# EasyEDA Pro project G-CU_2023-06-21_21-38-10.eprj, board PCB1
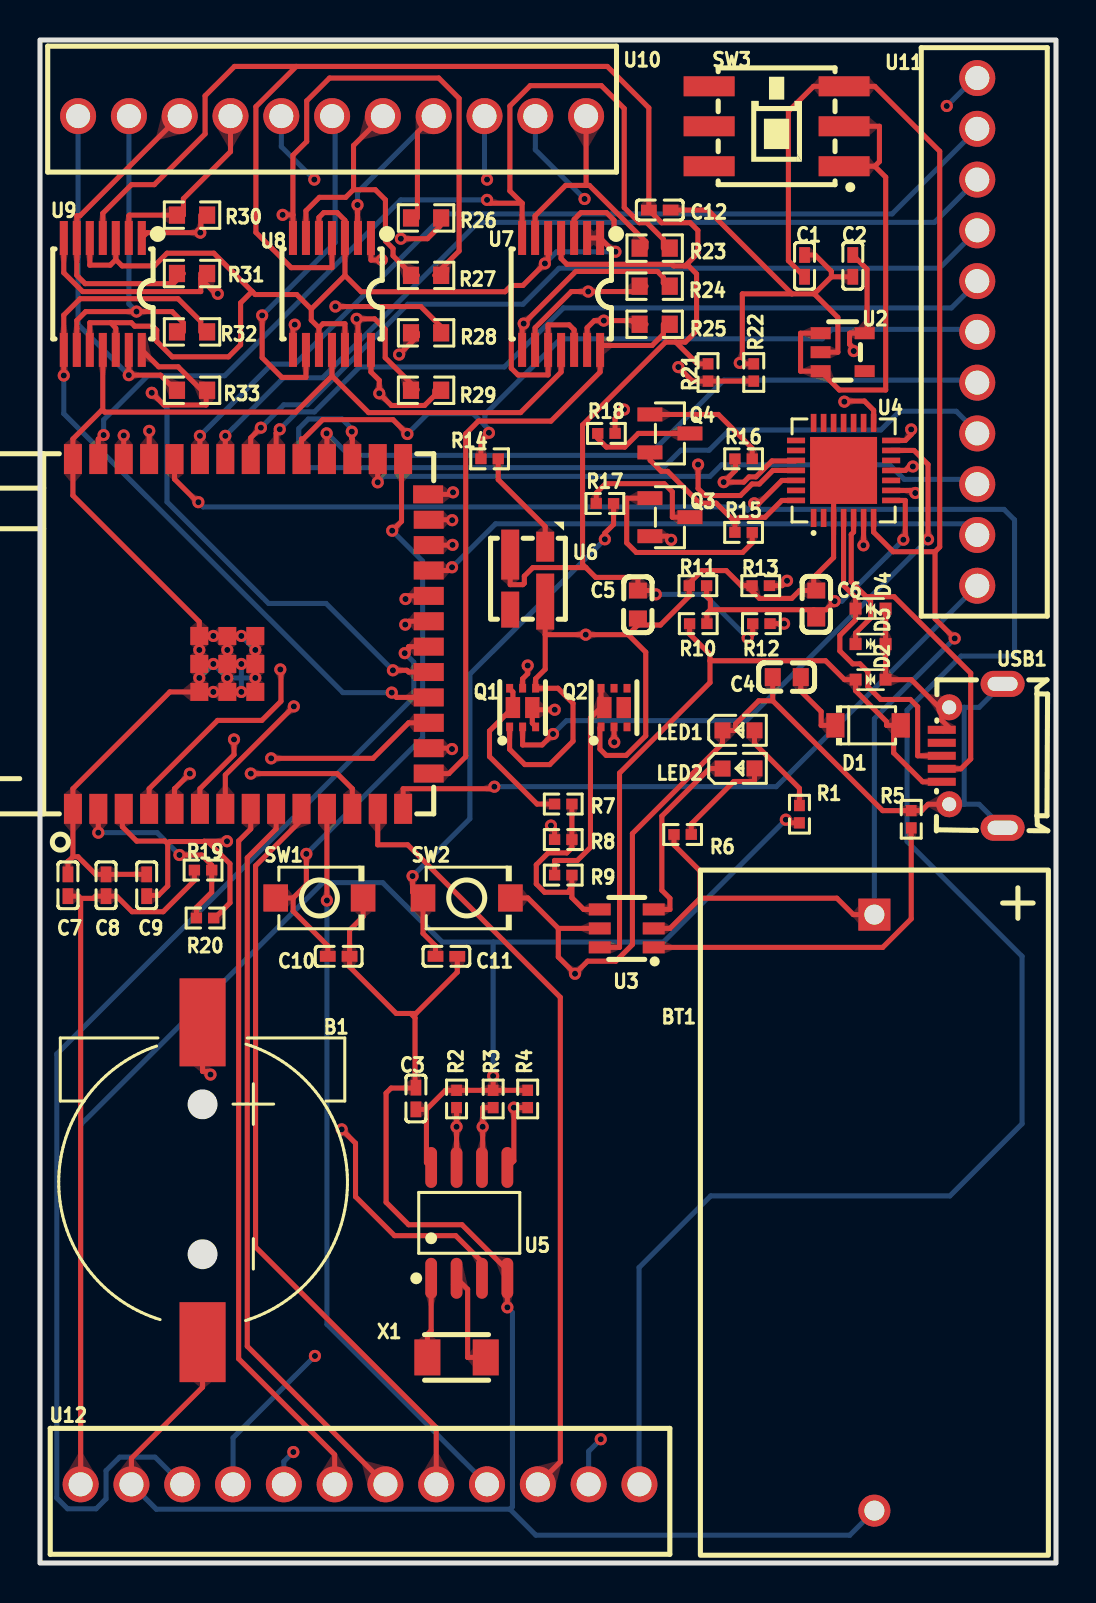
[diagram p1: board, top side]
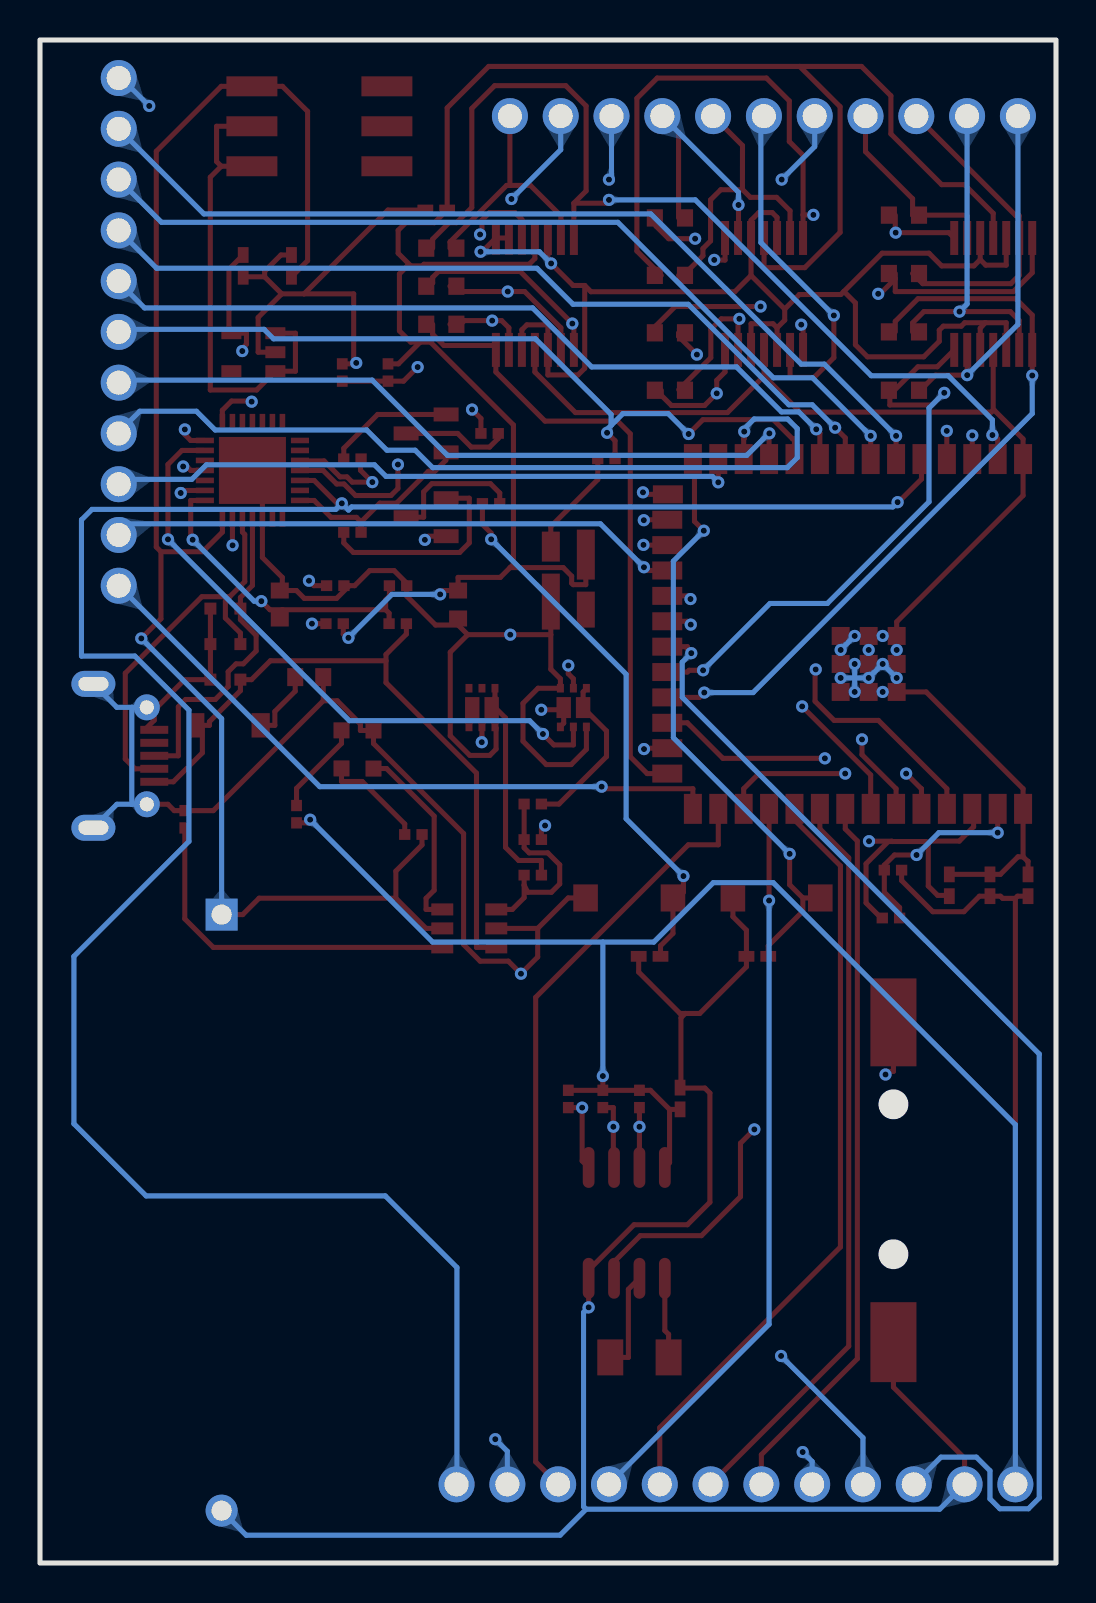
[diagram p2: board, bottom side, seen from below]

Outline 50.8 x 76.2 mm; copper layers: Top Layer, 信号层1, 信号层2, Bottom Layer. Coordinates in mm from the lower left corner of the outline.
Outline path: rectangle 0,76.2 50.8,0
Stack: Top Layer 0.035mm / Dielectric1 0.48mm PP er 4.5 / 信号层1 0.035mm / Dielectric2 0.48mm FR4 er 4.5 / 信号层2 0.035mm / Dielectric3 0.48mm PP er 4.5 / Bottom Layer 0.035mm

## Design rules (mm)
template: 自定义配置
spacing copperThickness1oz (default): track to track 0.102, other pairs 0.152 to 0.3
spacing copperThickness2oz: track to track 0.203, other pairs 0.152 to 0.3
spacing copperThicknessInner0.5oz: track to track 0.089, other pairs 0.152 to 0.3
track width copperThickness1oz (default): min 0.102, default 0.254, max 2.54
track width copperThickness2oz: min 0.203, default 0.254, max 2.54
track width copperThickness0.5oz: min 0.089, default 0.254, max 2.54
differential pair differentialPair (default): width min 0.127, default 0.254, max 2.54; gap min 0.152, default 0.152
via viaSize (default): diameter min 0.3, default 0.61, max 10; hole min 0.201, default 0.305, max 6.299

## Placement (name value [footprint] x y rotation side)
B1  CR1220-2  [BAT-SMD_CR1220-2]  8.13 19.05 270 top
BT1  BH-14250-A1AJ001  [14250]  50.42 34.67 270 top
C1  1uF  [c0402]  38.23 64.9 270 top
C2  1uF  [C0402]  40.64 64.9 90 top
C3  1uF  [C0402]  18.8 23.24 270 top
C4  10uF  [C0603]  37.34 44.32 0 top
C5  10uF  [C0603]  29.9 47.96 90 top
C6  1uF  [C0603]  38.81 47.96 270 top
C7  10uF  [C0402]  1.4 33.91 270 top
C8  100pF  [C0402]  3.3 33.91 270 top
C9  1uF  [C0402]  5.33 33.91 270 top
C10  100pF  [C0402]  14.93 30.35 180 top
C11  100pF  [C0402]  20.32 30.35 180 top
C12  100pF  [C0402]  30.99 67.69 0 top
D1  1N5819HW-7-F  [SOD-123_L2.7-W1.6-LS3.7-RD]  41.4 41.91 0 top
D2  LESD5D5.0CT1G  [SOD-523_L1.2-W0.8-LS1.6-BI]  41.53 44.2 180 top
D3  LESD5D5.0CT1G  [SOD-523_L1.2-W0.8-LS1.6-BI]  41.53 45.97 180 top
D4  LESD5D5.0CT1G  [SOD-523_L1.2-W0.8-LS1.6-BI]  41.53 47.75 180 top
LED1  NCD0603R1  [LED0603-RD_RED]  34.93 41.66 0 top
LED2  NCD0603G1  [LED0603-RD]  34.93 39.75 0 top
Q1  CSD87502Q2  [DFN-6L_L2.0-W2.0-P0.65-BL-EP]  24.13 42.8 0 top
Q2  CSD87502Q2  [DFN-6L_L2.0-W2.0-P0.65-BL-EP]  28.7 42.8 0 top
Q3  L8050QLT1G  [SOT-23-3_L2.9-W1.3-P1.90-LS2.4-BR]  31.5 52.32 180 top
Q4  L8050QLT1G  [SOT-23-3_L2.9-W1.3-P1.90-LS2.4-BR]  31.5 56.51 180 top
R1  5.1kΩ  [R0402]  37.97 37.46 90 top
R2  4.7kΩ  [R0402]  20.83 23.22 90 top
R3  4.7kΩ  [R0402]  22.66 23.22 90 top
R4  4.7kΩ  [R0402]  24.38 23.22 90 top
R5  10kΩ  [R0402]  43.56 37.21 270 top
R6  5.1kΩ  [R0402]  32.13 36.45 180 top
R7  5.9kΩ  [R0402]  26.16 37.97 0 top
R8  1.1kΩ  [R0402]  26.16 36.19 0 top
R9  680Ω  [R0402]  26.16 34.42 0 top
R10  22.1kΩ  [R0402]  32.91 47 180 top
R11  47.5kΩ  [R0402]  32.9 48.9 0 top
R12  1kΩ  [R0402]  36.07 47 180 top
R13  10kΩ  [R0402]  36.04 48.9 0 top
R14  0Ω  [R0402]  22.48 55.24 180 top
R15  10kΩ  [R0402]  35.18 51.56 0 top
R16  10kΩ  [R0402]  35.18 55.24 0 top
R17  0Ω  [R0402]  28.25 53.01 0 top
R18  0Ω  [R0402]  28.32 56.51 0 top
R19  0Ω  [R0402]  8.15 34.67 0 top
R20  0Ω  [R0402]  8.25 32.27 180 top
R21  1.8kΩ  [R0402]  33.4 59.56 90 top
R22  200Ω  [R0402]  35.69 59.56 270 top
R23  5kΩ  [R0603]  30.73 65.79 0 top
R24  5kΩ  [R0603]  30.73 63.88 0 top
R25  5kΩ  [R0603]  30.73 61.98 0 top
R26  5kΩ  [R0603]  19.3 67.3 0 top
R27  5kΩ  [R0603]  19.3 64.42 0 top
R28  5kΩ  [R0603]  19.3 61.55 0 top
R29  5kΩ  [R0603]  19.3 58.67 0 top
R30  5kΩ  [R0603]  7.6 67.44 0 top
R31  5kΩ  [R0603]  7.6 64.52 0 top
R32  5kΩ  [R0603]  7.6 61.59 0 top
R33  5kΩ  [R0603]  7.6 58.67 0 top
SW1  TS-1088-AR02016  [SW-SMD_L3.9-W3.0-P4.45]  13.97 33.27 0 top
SW2  TS-1088-AR02016  [SW-SMD_L3.9-W3.0-P4.45]  21.34 33.27 0 top
SW3  XKB5858-Z-TP  [SW-SMD_6P-L5.8-W5.8-P2.00-LS8.5-1]  36.83 71.88 180 top
U1  ESP32-S3-WROOM-1  [WIRELM-SMD_ESP32-S3-WROOM-1]  10.54 46.48 90 top
U2  TLV75733PDBVR  [SOT-23-5_L2.9-W1.6-P0.95-LS2.8-BL]  40.13 60.58 270 top
U3  BQ21040DBVR  [SOT-23-6_L2.9-W1.6-P0.95-LS2.8-BR]  29.34 31.75 0 top
U4  CP2102N-A02-GQFN28  [QFN-28_L5.0-W5.0-P0.50-TL-EP3.3]  40.18 54.66 90 top
U5  BQ32002D  [SOIC-8_L4.9-W3.9-P1.27-LS6.0-BL]  21.46 17.02 0 top
U6  SK6812mini  [LED-SMD_4P-L3.7-W3.5-P1.75-BR-SK6812MINI]  24.38 49.28 90 top
U7  OPA4314AIPWR  [TSSOP-14_L5.0-W4.4-P0.65-LS6.4-BL]  26.06 63.49 180 top
U8  OPA4314AIPWR  [TSSOP-14_L5.0-W4.4-P0.65-LS6.4-BL]  14.6 63.49 180 top
U9  OPA4314AIPWR  [TSSOP-14_L5.0-W4.4-P0.65-LS6.4-BL]  3.14 63.49 180 top
U10  JL308-25411G01  [CONN-TH_11P-P2.54_JILN_JL308-25411G01]  14.6 72.39 180 top
U11  JL308-25411G01  [CONN-TH_11P-P2.54_JILN_JL308-25411G01]  46.86 61.59 90 top
U12  JL308-25412G01  [CONN-TH_12P-P2.54_JILN_JL308-25412G01]  16 3.94 0 top
USB1  MicroXNJ  [MICRO-USB-SMD_MICROXNJ]  46.61 40.39 90 top
X1  32.768kHz  [CRYSTAL-SMD_L3.2-W1.5]  20.83 10.29 0 top

## Footprints (pads in the part's own frame, mm; a bottom-side part is the same pattern mirrored in y, then rotated)
14250
  rect 1.6x1.6 hole 1: 1(2.23,-8.7)
  round 1.6 hole 1: 2(32.05,-8.7)
BAT-SMD_CR1220-2
  rect 4.4x2.3 smd: 1(-8,0)
  rect 4x2.3 smd: 2(8,0)
c0402
  rect 0.79x0.54 smd: 1(-0.545,0) 2(0.545,0)
C0402
  rect 0.79x0.54 smd: 1(-0.545,0) 2(0.545,0)
C0603
  rect 0.8x0.9 smd: 1(-0.7,0) 2(0.7,0)
CONN-TH_11P-P2.54_JILN_JL308-25411G01
  round 1.8 hole 1.2: 1(-12.7,0) 2(-10.16,0) 3(-7.62,0) 4(-5.08,0) 5(-2.54,0) 6(0,0) 7(2.54,0) 8(5.08,0) 9(7.62,0) 10(10.16,0) 11(12.7,0)
CONN-TH_12P-P2.54_JILN_JL308-25412G01
  round 1.8 hole 1.2: 1(-13.97,0) 2(-11.43,0) 3(-8.89,0) 4(-6.35,0) 5(-3.81,0) 6(-1.27,0) 7(1.27,0) 8(3.81,0) 9(6.35,0) 10(8.89,0) 11(11.43,0) 12(13.97,0)
CRYSTAL-SMD_L3.2-W1.5
  rect 1.3x1.8 smd: 1(-1.458,0) 2(1.458,0)
DFN-6L_L2.0-W2.0-P0.65-BL-EP
  rect 0.35x0.43 smd: 1(-0.65,-0.968) 2(0,-0.968) 3(0.65,-0.968) 4(0.65,0.968) 5(0,0.968) 6(-0.65,0.968)
  rect 0.72x1.05 smd: 7(-0.485,0) 8(0.485,0)
LED0603-RD
  rect 0.8x0.8 smd: 1(-0.799,-0.004) 2(0.799,0.004)
LED0603-RD_RED
  rect 0.8x0.8 smd: 1(-0.799,-0.004) 2(0.799,0.004)
LED-SMD_4P-L3.7-W3.5-P1.75-BR-SK6812MINI
  rect 1.5x0.9 smd: 1(1.575,-0.875)
  rect 2.5x0.9 smd: 2(1.175,0.875)
  rect 1.8x0.9 smd: 3(-1.575,0.875)
  rect 2.8x0.9 smd: 4(-1.175,-0.875)
MICRO-USB-SMD_MICROXNJ
  rect 0.4x1.4 smd: 1(-1.3,1.522) 2(-0.65,1.522) 3(0,1.522) 4(0.65,1.522) 5(1.3,1.522)
  round 1.3 hole 0.7: 6(2.425,1.149) 9(-2.425,1.149)
  oval 1.3x2.2 hole 0.7x1.5: 7(3.6,-1.522) 8(-3.6,-1.522)
QFN-28_L5.0-W5.0-P0.50-TL-EP3.3
  rect 0.905x0.28 smd: 1(-2.377,1.5) 2(-2.377,1) 3(-2.377,0.5) 4(-2.377,0) 5(-2.377,-0.5) 6(-2.377,-1) 7(-2.377,-1.5) 15(2.377,-1.5) 16(2.377,-1) 17(2.377,-0.5) 18(2.377,0) 19(2.377,0.5) 20(2.377,1) 21(2.377,1.5)
  rect 0.28x0.905 smd: 8(-1.5,-2.377) 9(-1,-2.377) 10(-0.5,-2.377) 11(0,-2.377) 12(0.5,-2.377) 13(1,-2.377) 14(1.5,-2.377) 22(1.5,2.377) 23(1,2.377) 24(0.5,2.377) 25(0,2.377) 26(-0.5,2.377) 27(-1,2.377) 28(-1.5,2.377)
  rect 3.35x3.35 smd: 29(0,0)
R0402
  rect 0.566x0.54 smd: 1(-0.433,0) 2(0.433,0)
R0603
  rect 0.806x0.864 smd: 1(-0.753,0) 2(0.753,0)
SOD-123_L2.7-W1.6-LS3.7-RD
  rect 0.91x1.22 smd: 1(-1.635,0) 2(1.635,0)
SOD-523_L1.2-W0.8-LS1.6-BI
  rect 0.6x0.6 smd: 1(-0.75,0) 2(0.75,0)
SOIC-8_L4.9-W3.9-P1.27-LS6.0-BL
  oval 0.588x2.045 smd: 1(-1.905,-2.772) 2(-0.635,-2.772) 3(0.635,-2.772) 4(1.905,-2.772) 5(1.905,2.772) 6(0.635,2.772) 7(-0.635,2.772) 8(-1.905,2.772)
SOT-23-3_L2.9-W1.3-P1.90-LS2.4-BR
  rect 1.25x0.7 smd: 1(1,-0.95) 2(1,0.95) 3(-1,0)
SOT-23-5_L2.9-W1.6-P0.95-LS2.8-BL
  rect 0.6x1 smd: 1(-0.95,-1.1) 2(0,-1.1) 3(0.95,-1.1) 4(0.95,1.1) 5(-0.95,1.1)
SOT-23-6_L2.9-W1.6-P0.95-LS2.8-BR
  rect 1.1x0.6 smd: 1(1.35,-0.95) 2(1.35,0) 3(1.35,0.95) 4(-1.35,0.95) 5(-1.35,0) 6(-1.35,-0.95)
SW-SMD_6P-L5.8-W5.8-P2.00-LS8.5-1
  rect 2.55x1 smd: 1(-3.375,2) 2(-3.375,0) 3(-3.375,-2) 4(3.375,2) 5(3.375,0) 6(3.375,-2)
SW-SMD_L3.9-W3.0-P4.45
  rect 1.23x1.36 smd: 1(-2.185,0) 2(2.185,0)
TSSOP-14_L5.0-W4.4-P0.65-LS6.4-BL
  rect 0.4x1.7 smd: 1(-1.95,-2.8) 2(-1.3,-2.8) 3(-0.65,-2.8) 4(0,-2.8) 5(0.65,-2.8) 6(1.3,-2.8) 7(1.95,-2.8) 8(1.95,2.8) 9(1.3,2.8) 10(0.65,2.8) 11(0,2.8) 12(-0.65,2.8) 13(-1.3,2.8) 14(-1.95,2.8)
WIRELM-SMD_ESP32-S3-WROOM-1
  rect 1.5x0.9 smd: 1(-8.75,8.895) 2(-8.75,7.625) 3(-8.75,6.355) 4(-8.75,5.085) 5(-8.75,3.815) 6(-8.75,2.545) 7(-8.75,1.275) 8(-8.75,0.005) 9(-8.75,-1.265) 10(-8.75,-2.535) 11(-8.75,-3.805) 12(-8.75,-5.075) 13(-8.75,-6.345) 14(-8.75,-7.615) 27(8.75,-7.615) 28(8.75,-6.345) 29(8.75,-5.075) 30(8.75,-3.805) 31(8.75,-2.535) 32(8.75,-1.265) 33(8.75,0.005) 34(8.75,1.275) 35(8.75,2.545) 36(8.75,3.815) 37(8.75,5.085) 38(8.75,6.355) 39(8.75,7.625) 40(8.75,8.895)
  rect 0.9x1.5 smd: 15(-6.985,-8.895) 16(-5.715,-8.895) 17(-4.445,-8.895) 18(-3.175,-8.895) 19(-1.905,-8.895) 20(-0.635,-8.895) 21(0.635,-8.895) 22(1.905,-8.895) 23(3.175,-8.895) 24(4.445,-8.895) 25(5.715,-8.895) 26(6.985,-8.865)
  rect 0.9x0.9 smd: 41(-2.9,2.575) 41(-2.9,1.175) 41(-2.9,-0.225) 41(-1.5,2.575) 41(-1.5,1.175) 41(-1.5,-0.225) 41(-0.1,2.575) 41(-0.1,1.175) 41(-0.1,-0.225)

## Nets
As in the schematic.

Pads without a net: Q2 3 4 5 8; SW3 4 5 6; U2 4; U4 1 2 10 12 16 17 18 19 20 21 22 23 27; U6 3; USB1 4

## Via types
v1: diameter 0.61, hole 0.305, Top Layer to Bottom Layer, 116 vias

## Routing (per net, layer and track width the routed paths; a pad name or vN(x,y) marks a point on that pad's centre or on a via; arc(x,y) is an arc through that point)
GND: length 366.1
  Top Layer w0.254: 25.92,31.75 25.92,30.32 v1(26.75,29.48) 27.38,30.11 28.79,30.11 29.62,30.94 29.62,36.5 34.12,41 34.12,41.65 34.78,41.65 34.78,41.98 35.94,43.14 36.64,43.14 ; 25.92,31.75 U3.5 ; 25.92,31.75 24.39,33.27 23.52,33.27 ; 35.33,48.9 35.07,48.9 34.31,49.65 33.09,49.65 32.46,49.02 32.46,48.37 31.02,46.93 29.9,46.93 ; 35.33,48.9 35.97,48.26 37.59,48.26 37.98,48.66 38.68,48.66 38.68,49.31 39.68,50.31 U4.3 39.68,54.17 40.18,54.66 ; 35.33,48.9 R13.1 ; U6.4 25.26,46.45 ; 25.26,46.45 v1(27.29,46.45) 29.41,46.45 ; 25.26,46.45 25.26,44.72 24.78,44.24 24.78,43.77 25.9,43.77 26.65,43.01 26.65,41.12 25.49,39.95 24.24,39.95 23.48,40.71 Q1.1 ; 39.57,64.35 39.57,64.63 38.75,65.44 38.23,65.44 ; 39.57,64.35 C2.1 ; 39.57,64.35 38.71,63.5 ; 16.15,33.27 16.15,32.34 15.48,31.66 15.48,29.83 17.81,27.5 18.53,27.5 ; 14.6,59.39 16.43,57.56 24.03,57.56 26.06,59.59 U7.11 ; 14.6,59.39 12.79,57.58 3.24,57.58 3.14,57.68 ; 14.6,59.39 U8.11 ; USB1.5 45.56,41.69 45.09,42.16 45.09,42.68 ; 45.09,42.68 43.57,44.2 42.28,44.2 42.28,47.75 ; 45.09,42.68 45.22,42.81 USB1.6 ; 5.33,34.45 2.78,34.45 1.9,35.33 1.65,35.33 ; 36.64,43.14 36.64,44.32 ; 36.64,43.14 42.13,37.64 R5.1 44.09,37.64 44.4,37.96 45.46,37.96 ; Q2.1 28,41.78 28,40.72 28.31,40.41 29.31,40.41 30.29,41.39 30.29,45.57 29.41,46.45 ; 3.14,57.68 U9.11 ; 3.14,57.68 3.09,57.68 1.65,56.24 U1.40 1.65,53.41 7.97,47.09 v1(7.97,45.68) v1(7.97,44.28) U1.41 6.49,43.58 1.65,38.74 U1.1 1.65,35.33 ; U12.2 4.57,5.24 8.13,8.8 8.13,11.05 ; 18.53,27.5 18.8,27.5 20.87,29.56 20.87,30.35 ; 18.53,27.5 18.75,27.28 18.75,23.79 18.8,23.79 ; 1.65,35.33 1.42,35.11 1.4,35.11 1.4,34.45 ; 38.71,63.5 39.89,62.32 39.89,60.58 U2.2 ; 38.71,63.5 37.59,63.5 ; 10.77,46.38 v1(10.77,45.68) v1(10.77,44.28) 10.77,43.58 ; 29.41,46.45 29.9,46.93 ; 37.59,63.5 33.4,67.69 C12.2 ; 37.59,63.5 35.12,63.5 35.12,60.04 ; 35.12,60.04 35.16,59.99 R22.1 ; 35.12,60.04 v1(34.99,60.04) ; 29.9,46.93 C5.1 ; 23.37,14.25 v1(23.37,12.79) ; v1(8.67,43.58) U1.41 v1(9.37,44.28) v1(9.37,45.68) 9.37,46.38 v1(8.67,46.38) ; 18.8,23.78 18.79,23.76 17.56,23.76 17.31,23.51 17.31,18.05 18.43,16.92 21.1,16.92 23.39,14.63 23.39,14.3
  信号层1 w0.254: 27.34,46.45 26.75,45.86 v1(26.75,29.48) 26.75,16.17 v1(23.37,12.79) ; 27.34,46.45 v1(27.29,46.45) ; 27.34,46.45 27.34,52.39 v1(34.99,60.04)
  信号层2 w0.254: v1(27.29,46.45) 27.13,46.28 11.37,46.28 v1(10.77,45.68)
  Bottom Layer w0.254: 41.72,2.62 40.49,1.39 24.8,1.39 23.5,2.69 ; USB1.6 46.21,42.81 ; 46.21,42.81 46.96,42.81 48.13,43.98 ; 46.21,42.81 46.21,37.96 ; 48.13,36.79 46.96,37.96 46.21,37.96 ; 10.07,44.28 v1(9.37,44.28) v1(8.67,44.98) 7.97,44.28 ; 10.07,44.28 v1(10.77,44.28) ; 10.07,44.28 v1(10.07,44.98) ; 10.07,44.28 v1(10.07,43.58) ; 46.21,37.96 45.46,37.96 ; U12.2 5.82,2.69 23.5,2.69 ; v1(23.37,12.79) 23.62,12.54 23.62,2.82 23.5,2.69 ; v1(10.07,46.38) v1(10.77,45.68)
VBAT: length 78.3
  Top Layer w0.254: 33.01,33.26 39.84,33.26 40.67,32.44 BT1.1 ; 33.01,33.26 31.5,31.75 30.69,31.75 ; 33.01,33.26 33.01,34.62 31.7,35.93 31.7,36.45 ; 44.75,50.6 42.66,50.6 41.68,51.58 U4.7 ; 44.75,50.6 44.75,47.24 v1(45.74,46.26) ; 44.75,50.6 44.99,50.83 44.99,70.63 41.74,73.88 38.68,73.88 37.42,72.63 37.42,65.16 C1.2
  Bottom Layer w0.254: v1(45.74,46.26) 41.72,42.24 BT1.1
VBUS: length 35.2
  Top Layer w0.254: 32.48,47 32.48,46.47 33.5,45.46 33.5,45.14 ; 33.5,45.14 39.28,45.14 40.23,44.2 D2.2 40.78,43.64 42.33,42.09 42.33,41.91 42.68,41.91 ; 33.5,45.14 33.5,44.05 28.98,39.52 28.98,30.8 U3.6 ; 42.68,41.91 43.04,41.91 ; 42.68,41.91 42.68,40.53 44.13,39.09 USB1.1
VCC_3V3: length 254.6
  Top Layer w0.254: C7.2 1.92,33.36 2.03,33.25 ; R4.2 22.66,23.65 ; 22.66,23.65 v1(22.66,24.36) ; 22.66,23.65 R2.2 20.28,23.65 19.32,22.69 ; 27.29,49.8 27.13,49.97 27.13,56.94 31.27,61.08 31.79,61.08 ; 27.29,49.8 24.64,49.8 24.22,49.37 24.22,49.02 24.14,48.95 23.51,48.95 23.51,50.45 ; 27.29,49.8 27.78,49.31 29.9,49.31 C5.2 30.6,48.66 v1(30.79,48.46) ; 41.14,61.53 40.48,61.53 40.48,60.98 40.69,60.77 v1(40.69,60.64) ; 41.14,61.53 41.23,61.53 ; 41.14,61.53 41.35,61.74 41.35,64.73 40.64,65.44 ; C12.1 31.08,67.06 32.51,67.06 32.89,66.67 32.89,65.53 32.26,64.9 ; 19.32,22.69 C3.2 ; 19.32,22.69 19.32,20.03 19.56,19.79 ; U7.4 26.06,65.27 26.34,64.98 31.6,64.98 31.68,64.9 32.26,64.9 ; 2.03,33.25 2.67,33.25 2.78,33.36 C8.2 3.83,33.36 4.61,32.59 6.16,32.59 7.72,34.14 R19.1 ; 2.03,33.25 U12.1 ; U8.4 14.6,64.81 12.56,64.81 10.79,66.57 10.79,72.86 12.81,74.88 ; 12.81,74.88 28.37,74.88 30.44,72.8 30.44,67.69 ; 12.81,74.88 9.73,74.88 8.25,73.41 8.25,71.5 5.72,68.96 4.57,68.96 3.14,67.53 U9.4 ; R21.2 32.88,59.99 31.79,61.08 ; v1(37.29,37.19) 37.45,37.03 R1.1 ; 31.79,61.08 32.26,61.08 32.83,61.65 32.83,64.5 32.43,64.9 32.26,64.9 ; R12.2 35.64,46.47 35.56,46.47 v1(35.38,46.29) ; v1(41.17,50.92) 41.18,50.92 41.18,52.29
  信号层1 w0.254: v1(37.29,37.19) 36.19,38.29 36.19,46.29 ; v1(41.17,50.92) 40.24,50.92 36.19,46.87 36.19,46.29 ; 36.19,46.29 v1(35.38,46.29)
  信号层2 w0.254: v1(40.69,60.64) 41.17,60.15 v1(41.17,50.92)
  Bottom Layer w0.254: 22.66,31.07 20.11,31.07 17.14,34.04 14.14,34.04 2.03,21.93 U12.1 ; 22.66,31.07 v1(22.66,24.36) ; 22.66,31.07 31.17,31.07 v1(37.29,37.19) ; v1(30.79,48.46) 33.2,48.46 v1(35.38,46.29)
VCC_5V: length 3.5
  Top Layer w0.254: 38.04,44.32 38.04,43.62 39.06,42.6 39.06,41.91 39.77,41.91
CHIP_PU: length 52.6
  Top Layer w0.254: 6.39,35.98 6.5,36.1 8.19,36.1 ; 6.39,35.98 6.25,36.12 4.83,36.12 4.12,36.84 4.12,37.76 ; 6.39,35.98 6.39,33.87 5.92,33.4 5.36,33.4 ; 8.19,36.1 8.38,36.1 9.5,34.98 9.5,33.03 8.69,32.22 ; 8.19,36.1 8.2,36.11 v1(9.35,36.11) ; SW2.1 19.15,33.04 ; 19.15,33.04 19.15,31.5 19.77,30.88 19.77,30.35 ; 19.15,33.04 18.63,33.56 v1(18.63,34.37) ; v1(28.24,51.22) 28.24,51.53 28.68,51.96 28.68,53.01
  信号层2 w0.254: v1(18.63,34.37) 14.46,34.37 14.1,34.01 11.45,34.01 v1(9.35,36.11)
  Bottom Layer w0.254: v1(28.24,51.22) 21.49,44.47 21.49,37.23 v1(18.63,34.37)
CHR0: length 25.7
  Top Layer w0.254: v1(24.38,44.9) 24.38,44.49 24.13,44.24 24.13,43.77 ; 41.68,57.04 41.68,57.67 41.22,58.13 40.25,58.13 v1(40.22,58.1)
  信号层2 w0.254: 40.21,58.1 40.21,56.67 28.45,44.9 v1(24.38,44.9)
CHR1: length 23.9
  Top Layer w0.254: v1(43.56,56.71) 43.56,56.46 43.26,56.16 42.56,56.16 ; Q2.2 28.7,41.36 28.71,41.35 v1(28.71,41.07)
  信号层1 w0.254: v1(43.56,56.71) 28.71,41.87 v1(28.71,41.07)
CHREN: length 31.3
  Top Layer w0.254: v1(44.4,51.22) 44.4,54.96 43.7,55.66 U4.13 ; Q1.2 24.13,40.93 25.11,40.93 v1(25.65,41.48)
  Bottom Layer w0.254: v1(44.4,51.22) 35.33,42.14 26.32,42.14 v1(25.65,41.48)
DTR: length 9.9
  Top Layer w0.254: 30.51,55.53 30.51,55.17 31.06,54.62 31.38,54.62 32.97,53.03 33.81,53.03 34.75,52.09 ; 34.75,52.09 34.75,51.56 ; 34.75,52.09 34.98,52.32 36.25,52.32 37.09,53.16 37.8,53.16
ESP_3V3: length 10.5
  Top Layer w0.254: v1(2.92,36.54) U1.2 ; R20.2 7.82,32.8 8.59,33.56 R19.2 8.59,34.91 8.08,35.42 v1(6.97,35.42)
  Bottom Layer w0.254: v1(6.97,35.42) 5.86,36.54 v1(2.92,36.54)
GIN0: length 12.2
  Top Layer w0.254: 27.31,68.92 U10.1 ; 27.31,68.92 26.28,68.92 24.75,67.4 U7.6 ; 27.31,68.92 27.47,68.92 30.3,66.09 30.3,65.79
GIN1: length 17.4
  Top Layer w0.254: U7.9 24.75,61.8 26.57,63.61 v1(27.41,63.61) 30.03,63.61 30.3,63.88
  信号层1 w0.254: v1(27.23,68.24) 27.23,63.8 v1(27.41,63.61)
  Bottom Layer w0.254: U10.2 24.76,70.71 v1(27.23,68.24)
GIN2: length 17.6
  Top Layer w0.254: 30.3,61.98 29.77,61.98 29.58,62.16 v1(28.19,62.16) 27.72,62.16 27.36,61.8 U7.13
  信号层1 w0.254: v1(28.19,62.16) 27.11,62.16 26.06,63.21 26.06,65.5 v1(22.35,69.21)
  Bottom Layer w0.254: U10.3 22.22,69.34 v1(22.35,69.21)
GIN3: length 13.1
  Top Layer w0.254: v1(15.88,67.94) 15.88,66.32 U8.2 ; 18.87,67.3 18.87,71.58 U10.4
  Bottom Layer w0.254: U10.4 15.88,68.58 v1(15.88,67.94)
GIN4: length 14.9
  Top Layer w0.254: U10.5 15.68,70.92 15.68,68.72 15.66,68.71 ; 15.66,68.71 15.28,68.33 13.97,68.33 13.3,67.65 U8.6 ; 15.66,68.71 16.76,68.71 17.27,68.2 17.27,66.14 17.65,65.76 17.65,65.4 18.64,64.42 18.87,64.42
GIN5: length 26.8
  Top Layer w0.254: 13.3,60.69 13.3,59.32 12.09,59.32 11.11,60.3 v1(11.11,62.42) ; 18.87,61.55 18.87,61.38 v1(17.96,60.46)
  信号层2 w0.254: v1(17.96,60.46) 13.07,60.46 v1(11.11,62.42)
  Bottom Layer w0.254: U10.6 14.76,72.24 14.76,66.07 v1(11.11,62.42)
GIN6: length 18.6
  Top Layer w0.254: 18.86,58.7 17.26,60.31 17.26,61.72 16.73,62.25 v1(15.83,62.25) 15.9,62.18 U8.13
  信号层1 w0.254: v1(15.83,62.25) 15.83,67.1 v1(13.72,69.21)
  Bottom Layer w0.254: v1(13.72,69.21) 12.06,70.87 U10.7
GIN7: length 9.8
  Top Layer w0.254: U10.8 9.53,70.61 7.17,68.26 7.17,67.44 4.48,67.44 4.44,67.4 U9.2
GIN8: length 15.9
  Top Layer w0.254: 7.17,64.52 6.66,64.01 2.26,64.01 1.84,64.43 U9.6 1.84,67.4 2,67.4 U10.9
GIN9: length 17.6
  Top Layer w0.254: 7.17,61.59 7.17,62.04 6.6,62.61 v1(4.83,62.61) 2.29,62.61 1.84,62.16 1.84,60.69
  Bottom Layer w0.254: U10.10 4.44,62.99 v1(4.83,62.61)
GIN10: length 17.9
  Top Layer w0.254: 6.78,58.67 6.03,59.43 v1(4.44,59.43) U9.13
  Bottom Layer w0.254: v1(4.44,59.43) 1.91,61.97 U10.11
GPIO0: length 45.4
  Top Layer w0.254: 12.66,33.27 12.66,32.61 14.39,30.88 C10.2 ; 12.66,33.27 13.32,33.93 v1(13.32,35.48) ; 12.66,33.27 11.79,33.27 ; v1(29.2,57.71) 28.75,57.26 28.75,56.51 ; 18.08,55.2 18.08,52.11 v1(17.61,51.65)
  信号层1 w0.254: v1(29.2,57.71) 24.25,52.76 18.72,52.76 v1(17.61,51.65)
  Bottom Layer w0.254: v1(17.61,51.65) 19.13,50.13 19.13,41.29 v1(13.32,35.48)
GPIO1: length 49.1
  Top Layer w0.254: v1(22.35,68.2) 22.52,68.03 24.11,68.03 ; 24.11,68.03 23.5,68.65 23.5,72.9 24.51,73.91 28.07,73.91 29.21,72.77 29.21,67.82 29.97,67.06 30.34,67.06 31.17,66.23 31.17,65.79 ; 24.11,68.03 24.11,66.29 ; U1.39 2.92,56.24 2.98,56.24 v1(3.18,56.43)
  Bottom Layer w0.254: v1(3.18,56.43) 3.18,57.2 5.39,59.4 9.24,59.4 18.03,68.2 v1(22.35,68.2)
GPIO2: length 33.5
  Top Layer w0.254: 24.11,60.69 24.11,61.8 24.18,61.87 v1(24.18,62.01) 26.79,64.62 30.87,64.62 31.17,64.33 31.17,64.04 31.31,63.9 ; U1.38 v1(4.19,56.41)
  信号层2 w0.254: v1(4.19,56.41) 5.36,57.59 19.76,57.59 v1(24.18,62.01)
GPIO3: length 31.4
  Top Layer w0.254: 31.17,61.98 31.17,61.48 30.61,60.92 28.08,60.92 28.03,60.86 ; U7.14 28.01,59.59 25.55,57.13 21.92,57.13 21.29,56.5 21.29,40.34 20.44,39.5 U1.15
GPIO4: length 44.1
  Top Layer w0.254: v1(18.04,66.26) 19.37,66.26 20,66.89 20,67.52 ; U8.1 16.55,65.19 17.08,65.19 v1(17.09,65.2) ; v1(12.02,44.71) 12.05,44.67 12.05,43.11 11.09,42.16 8.88,42.16 5.46,38.74 U1.4
  信号层1 w0.254: v1(12.02,44.71) 12.02,46.31 9.85,48.48 9.85,59.9 11,61.05 15.61,61.05 16.83,62.26 16.83,64.94 v1(17.09,65.2) 18.04,66.15 v1(18.04,66.26)
GPIO5: length 68.6
  Top Layer w0.254: v1(7.49,39.5) 6.73,38.74 6.73,38.74 U1.5 ; 19.74,64.42 20.96,65.64 20.96,73.28 19.94,74.29 14.48,74.29 13.34,73.15 13.34,71.12 12.65,70.43 12.65,67.45 ; 12.65,67.45 12.65,66.29 ; 12.65,67.45 v1(12.13,67.45)
  信号层1 w0.254: v1(12.13,67.45) 11,68.58 3.94,68.58 1.77,66.42 1.77,45.22 v1(7.49,39.5)
GPIO6: length 41.3
  Top Layer w0.254: 20,61.28 20,61.9 19.04,62.86 v1(14.77,62.86) ; v1(9.7,41.21) 9.7,40.44 8,38.74 U1.6 ; 12.65,60.69 12.65,61.86 v1(12.74,61.96)
  信号层1 w0.254: v1(14.77,62.86) 13.86,61.96 v1(12.74,61.96) 12.31,61.53 8.18,61.53 6.87,60.21 6.87,43.29 8.96,41.2 8.97,41.21 v1(9.7,41.21)
GPIO7: length 34.8
  Top Layer w0.254: 19.74,58.67 19.74,58.42 19.23,57.91 17.57,57.91 v1(16.96,58.52) 16.96,59.17 16.55,59.59 U8.14 ; v1(12.69,42.86) 9.27,39.43 U1.7
  信号层1 w0.254: v1(12.69,42.86) 12.69,46.48 10.32,48.85 10.32,57 11.54,58.21 16.66,58.21 v1(16.96,58.52)
GPIO8: length 47.1
  Top Layer w0.254: v1(10.54,39.5) 14.86,39.5 15.62,38.74 U1.12 ; 5.09,66.29 5.36,66.56 v1(8.02,66.56) 8.04,66.58 8.04,67.44
  信号层1 w0.254: v1(8.02,66.56) 2.93,66.56 2.29,65.91 2.29,46.1 8.89,39.5 v1(10.54,39.5)
GPIO9: length 47.7
  Top Layer w0.254: 8.04,64.25 8.04,63.61 2.13,63.61 1.19,64.55 U9.7 ; 8.04,64.25 8.79,63.5 v1(8.89,63.5) ; 8.04,64.25 8.04,64.52 ; v1(11.56,40.26) 16.66,40.26 18.43,42.04 U1.17
  信号层1 w0.254: v1(11.56,40.26) 9.14,40.26 6.17,43.23 6.17,60.78 v1(8.89,63.5)
GPIO10: length 37.2
  Top Layer w0.254: v1(17.59,43.55) 17.83,43.31 U1.18 ; v1(1.19,59.41) U9.8 1.19,62.44 2.01,63.26 6.9,63.26 8.04,62.12 8.04,61.59
  Bottom Layer w0.254: v1(1.19,59.41) 1.19,57.51 15.15,43.55 v1(17.59,43.55)
GPIO11: length 30
  Top Layer w0.254: 5.09,60.69 5.93,59.85 6.91,59.85 8.31,58.45 8.31,57.94 6.2,57.94 v1(5.59,58.55) ; U1.19 18.43,44.58 18.35,44.66 v1(17.65,44.66)
  Bottom Layer w0.254: v1(5.59,58.55) 6.35,57.78 6.35,53.09 11.43,48.01 14.3,48.01 v1(17.65,44.66)
GPIO12: length 60.2
  Top Layer w0.254: v1(18.24,45.52) 18.43,45.71 18.43,45.85 19.44,45.85
  Bottom Layer w0.254: v1(18.24,45.52) 18.69,45.07 18.69,43.31 0.84,25.47 0.84,3.26 1.38,2.72 2.81,2.72 3.3,3.21 3.3,4.62 3.98,5.3 5.75,5.3 U12.3
GPIO13: length 47.8
  Top Layer w0.254: U1.21 18.43,47.12 v1(18.26,46.95)
  信号层1 w0.254: v1(18.26,46.95) 16.7,45.38 16.7,13.31 v1(13.75,10.36)
  Bottom Layer w0.254: U12.4 9.65,6.27 v1(13.75,10.36)
GPIO14: length 48
  Top Layer w0.254: U1.22 18.43,48.39 v1(18.28,48.23)
  信号层1 w0.254: v1(18.28,48.23) 15.82,45.77 15.82,18.48 12.67,15.33 v1(12.67,5.55)
  Bottom Layer w0.254: v1(12.67,5.55) 12.19,5.08 U12.5
GPIO15: length 36
  Top Layer w0.254: U12.6 14.73,5.42 9.93,10.22 9.93,36.13 10.54,36.73 U1.8
GPIO16: length 37.3
  Top Layer w0.254: U12.7 10.36,10.84 10.36,35.29 11.81,36.73 U1.9
GPIO17: length 38.5
  Top Layer w0.254: U1.10 13.08,37.18 10.78,34.88 10.78,15.81 19.81,6.78 U12.8
GPIO18: length 37.1
  Top Layer w0.254: v1(14.35,33.15) U1.11
  Bottom Layer w0.254: U12.9 14.35,11.94 v1(14.35,33.15)
GPIO19: length 38.9
  Top Layer w0.254: U12.10 26.02,5.06 26.02,28.3 18.39,35.93 16.89,35.93 U1.13
GPIO20: length 34.1
  Top Layer w0.254: U1.14 18.16,38.74 22.61,38.74 v1(22.72,38.84)
  Bottom Layer w0.254: 46.99,49.02 36.81,38.84 v1(22.72,38.84)
GPIO21: length 28.7
  Top Layer w0.254: v1(20.6,49.82) 20.44,49.66 U1.23
  Bottom Layer w0.254: 46.99,51.56 46.56,51.99 22.78,51.99 v1(20.6,49.82)
GPIO35: length 31.8
  Top Layer w0.254: v1(16.89,54.07) U1.28
  Bottom Layer w0.254: v1(16.89,54.07) 17.18,54.36 33.5,54.36 34.08,54.94 42.48,54.94 43.21,54.22 46.88,54.22
GPIO36: length 41.8
  Top Layer w0.254: U1.29 15.62,56.24 15.59,56.26 v1(15.59,56.61)
  Bottom Layer w0.254: 46.89,56.55 45.81,57.62 42.98,57.62 42.04,56.69 34.47,56.69 33.45,55.67 32.04,55.67 31.17,54.8 13.43,54.8 12.94,55.3 12.94,56.76 13.42,57.24 15.09,57.24 15.59,56.74 v1(15.59,56.61)
GPIO37: length 36
  Top Layer w0.254: U1.30 14.35,56.5 v1(14.33,56.52)
  Bottom Layer w0.254: v1(14.33,56.52) 14.36,56.52 15.46,55.42 30.43,55.42 34.19,59.18 46.99,59.18
GPIO38: length 40.5
  Top Layer w0.254: U1.31 13.08,56.24 13.17,56.24 14.13,57.2 17.65,57.2 v1(18.37,56.49) ; 22.05,55.24 22.05,56.15 v1(22.45,56.55)
  Bottom Layer w0.254: 22.24,56.92 21.65,57.51 19.39,57.51 v1(18.37,56.49) ; 22.24,56.92 22.45,56.71 v1(22.45,56.55) ; 22.24,56.92 22.24,57.46 26.03,61.25 39.12,61.25 39.6,61.72 46.99,61.72
GPIO39: length 39.6
  Top Layer w0.254: v1(11.99,56.72) 11.81,56.54 U1.32
  Bottom Layer w0.254: v1(11.99,56.72) 12.86,57.59 13.72,57.59 15.97,59.84 23.22,59.84 26.17,62.79 45.57,62.79 46.91,64.14
GPIO40: length 41.9
  Top Layer w0.254: v1(11.04,56.8) 10.54,56.29 U1.33
  Bottom Layer w0.254: 46.99,66.8 44.97,64.78 25.95,64.78 24.15,62.98 18.39,62.98 13.36,57.95 12.19,57.95 v1(11.04,56.8)
GPIO41: length 44.2
  Top Layer w0.254: v1(9.27,56.39) U1.34
  Bottom Layer w0.254: v1(9.27,56.39) 12.17,59.3 14.13,59.3 21.91,67.08 44.72,67.08 46.99,69.34
GPIO42: length 46.6
  Top Layer w0.254: v1(8,56.39) U1.35
  Bottom Layer w0.254: v1(8,56.39) 11.58,59.98 12.74,59.98 20.26,67.5 42.61,67.5 46.99,71.88
GPIO45: length 37.2
  Top Layer w0.254: U1.26 20.55,53.47 v1(20.65,53.57)
  信号层1 w0.254: v1(20.65,53.57) 25.82,58.73 32.78,58.73 45.34,71.3 v1(45.34,72.9)
  Bottom Layer w0.254: v1(45.34,72.9) 46.86,74.42 46.99,74.42
IRQ#: length 23.2
  Top Layer w0.254: v1(20.6,40.72) 20.49,40.72 20.44,40.77 U1.16 ; R2.1 v1(20.83,21.83) 20.83,19.79
  信号层1 w0.254: v1(20.83,21.83) 20.6,22.05 v1(20.6,40.72)
RTS: length 10.6
  Top Layer w0.254: 34.78,55.25 34.78,54.67 v1(34.18,54.08) 35.19,54.08 35.45,54.34 35.8,54.34 36.6,55.14 37.77,55.14 ; v1(31.56,51.19) 31.38,51.37 Q3.2
  信号层1 w0.254: v1(34.18,54.08) 31.56,51.45 v1(31.56,51.19)
SCL: length 34.5
  Top Layer w0.254: U1.24 20.44,50.93 20.45,50.94 v1(20.63,50.94) ; 22.66,22.78 22.13,22.78 v1(22.13,21.83) 22.13,19.83 22.1,19.79
  信号层1 w0.254: v1(22.13,21.83) 21.3,22.66 21.3,50.27 v1(20.63,50.94)
SDA: length 35.7
  Top Layer w0.254: U1.25 20.44,52.2 20.47,52.17 v1(20.61,52.17) ; R4.1 v1(23.69,22.78) 23.69,20.12 23.37,19.79
  信号层1 w0.254: v1(23.69,22.78) 23.69,49.09 v1(20.61,52.17)
U0RXD: length 116.1
  Top Layer w0.254: v1(35.71,53.02) 35.95,53.02 37.09,54.16 37.8,54.16 ; U1.36 6.73,54.23 7.88,53.08 v1(7.92,53.08)
  Bottom Layer w0.254: 29.95,3.85 29.95,14.79 33.54,18.37 45.5,18.37 49.1,21.98 49.1,30.35 43.35,36.1 43.35,42.67 46.06,45.38 48.73,45.38 48.73,52.19 48.2,52.71 36.01,52.71 v1(35.71,53.02) 35.37,52.68 35.22,52.84 8.16,52.84 v1(7.92,53.08)
U0TXD: length 89.6
  Top Layer w0.254: 37.8,54.66 36.64,54.66 35.97,53.98 35.6,53.98 35.02,53.41 33.25,53.41 32.9,53.76 v1(32.9,54.96) ; v1(5.46,56.64) 5.46,55.24 U1.37
  信号层1 w0.254: v1(28.04,6.19) 28.04,50.09 v1(32.9,54.96)
  信号层2 w0.254: v1(5.46,56.64) 7.14,54.96 v1(32.9,54.96)
  Bottom Layer w0.254: U12.11 27.43,5.59 v1(28.04,6.19)
USB_D+: length 16.4
  Top Layer w0.254: USB1.3 43.88,40.39 43.88,42.84 43.52,43.2 42.03,43.2 41.39,43.85 41.39,44.59 41,44.99 40.64,44.99 39.99,45.63 39.99,46.41 40.78,47.2 D4.2 40.78,48.31 40.18,48.91 40.18,52.29
USB_D-: length 19.8
  Top Layer w0.254: 41.32,48.35 41.53,48.13 41.53,47.28 40.78,46.53 D3.2 ; 41.32,48.35 40.56,49.1 40.56,51.46 40.68,51.58 40.68,52.29 ; 41.32,48.35 42.71,48.35 46.54,44.52 46.54,40.23 46.04,39.74 USB1.2
VOUT1: length 71.1
  Top Layer w0.254: 23.56,63.92 23.25,63.6 16.06,63.6 15.25,64.42 ; 23.56,63.92 23.56,59.77 23.9,59.44 25.41,59.44 25.41,61.95 26.46,61.95 26.71,61.7 U7.12 ; 23.56,63.92 24.15,63.92 v1(25.25,65.02) 25.25,65.03 25.41,65.19 25.41,66.29 ; 13.56,62.74 13.56,62.18 13.95,61.8 ; 13.56,62.74 12.83,63.46 10.76,63.46 10.6,63.62 ; 13.56,62.74 15.25,64.42 ; U8.12 15.25,62 14.15,62 13.95,61.8 ; U8.10 13.95,61.8 ; v1(28.77,65.6) 28.7,65.6 U7.1 U7.2 ; U8.5 13.95,67.32 14.19,67.56 14.86,67.56 15.25,67.18 U8.3 15.25,64.42 ; 3.79,66.29 3.79,65.21 ; 3.79,65.21 3.51,64.93 2.49,64.93 U9.5 ; 3.79,65.21 4.1,64.9 5.72,64.9 6.35,65.53 8.69,65.53 10.6,63.62 ; 3.54,62.05 3.79,61.78 3.79,60.69 ; 3.54,62.05 4.56,62.05 4.74,61.88 5.64,61.88 5.84,61.68 5.84,61.12 6.61,60.35 9.43,60.35 10.03,60.95 10.03,63.04 10.6,63.62 ; 3.54,62.05 2.49,62.05 U9.10
  Bottom Layer w0.254: v1(25.25,65.02) 25.83,65.6 v1(28.77,65.6)
$1N2540: length 4.7
  Top Layer w0.254: 35.72,41.66 35.72,41.01 37.97,38.76 37.97,37.9
$1N2933: length 4
  Top Layer w0.254: X1.1 19.37,11.44 19.56,11.63 19.56,14.25
$1N2943: length 5.1
  Top Layer w0.254: X1.2 21.38,10.29 21.38,13.7 20.83,14.25
$1N2977: length 21.9
  Top Layer w0.254: v1(8.52,24.44) 8.37,24.6 8.13,24.6 8.13,27.05 ; v1(15.08,21.69) 15.78,21 15.78,18.33 17.73,16.38 20.79,16.38 22.07,15.1
  信号层1 w0.254: v1(15.08,21.69) 12.34,24.44 v1(8.52,24.44)
$1N5698: length 18
  Top Layer w0.254: 43.56,36.78 43.56,32.23 42.13,30.8 30.69,30.8
$1N5744: length 5.2
  Top Layer w0.254: R6.1 32.56,36.97 34.69,39.1 35.72,39.1 LED2.2
$1N5776: length 9.7
  Top Layer w0.254: 34.12,39.75 33.47,39.75 31.09,37.37 31.09,33.66 31.5,33.26 31.5,32.7 30.69,32.7
$1N6032: length 10.2
  Top Layer w0.254: 26.59,33.92 26.41,33.56 25.23,33.56 24.81,33.97 24.81,34.93 25.41,35.53 26.34,35.53 26.59,35.78 26.59,37.97 ; 26.59,33.92 26.59,34.42 ; 26.59,33.92 26.59,33.29 27.18,32.7 U3.4
$1N6640: length 8.2
  Top Layer w0.254: 23.48,43.77 23.48,43.75 23.65,43.58 Q1.7 22.47,41.63 22.47,40.35 24.85,37.97 25.73,37.97
$1N6646: length 9.3
  Top Layer w0.254: Q1.8 24.62,42.41 ; 24.62,42.41 24.9,42.69 v1(25.74,42.69) ; 24.62,42.41 24.62,42.02 24.78,41.85 Q1.3 ; 25.73,36.19 25.73,36.72 25.72,36.72 v1(25.55,36.9)
  信号层1 w0.254: v1(25.74,42.69) 25.06,42.02 25.06,37.38 v1(25.55,36.9)
$1N6659: length 11.2
  Top Layer w0.254: 28.04,42.8 27.52,42.28 27.52,35.8 26.87,35.15 25.73,35.15 25.73,34.42 ; 28.04,42.8 Q2.7 ; 28.04,42.8 28.04,43.29 28.05,43.3 28.05,43.77
$1N7305: length 16.3
  Top Layer w0.254: 42.56,53.16 43.26,53.16 43.26,51.29 v1(43.17,51.2) ; 33.52,47.69 33.52,48.19 33.33,48.37 R11.2 ; 33.52,47.69 33.34,47.52 33.34,47 ; 33.52,47.69 38.68,47.69 ; 38.68,47.26 38.68,47.69 ; 38.68,47.69 39.3,47.69 v1(39.73,48.12)
  Bottom Layer w0.254: v1(39.73,48.12) 40.09,48.12 v1(43.17,51.2)
$1N7502: length 11.8
  Top Layer w0.254: 42.56,53.66 43.63,53.66 v1(43.76,53.54) ; R12.1 v1(37.2,47)
  信号层1 w0.254: v1(37.2,47) 39.54,49.34 40.48,49.34 43.76,52.62 v1(43.76,53.54)
$1N7540: length 10.8
  Top Layer w0.254: v1(43.64,54.86) 43.46,54.86 43.26,54.66 U4.11 ; v1(37.35,49.14) 37.1,48.9 R13.2
  信号层1 w0.254: v1(43.64,54.86) 43.07,54.86 v1(37.35,49.14)
$1N7794: length 5.4
  Top Layer w0.254: R14.1 22.91,54.21 25.26,51.86 U6.1
$1N8190: length 6.8
  Top Layer w0.254: Q3.3 31.62,52.32 31.62,53.59 31.21,54 28.28,54 27.81,53.54 27.81,53.01
$1N8194: length 5.3
  Top Layer w0.254: Q4.3 29.92,56.51 29.24,55.83 28.32,55.83 27.89,56.26 R18.1
$1N8229: length 10.6
  Top Layer w0.254: Q3.1 29.34,53.27 29.34,51.04 29.81,50.56 35.13,50.56 35.61,51.04 R15.2
$1N8232: length 6.3
  Top Layer w0.254: Q4.1 33.92,57.46 35.61,55.77 R16.2
$1N11489: length 16
  Top Layer w0.254: U7.3 26.71,67.22 27.05,67.56 28.32,67.56 28.7,67.18 28.7,66.56 v1(28.8,66.47) ; 35.69,59.13 32.62,59.13 v1(31.92,59.83)
  信号层1 w0.254: v1(28.8,66.47) 29.54,65.72 29.54,62.21 v1(31.92,59.83)
$1N12314: length 24.3
  Top Layer w0.254: 39.03,61.53 38.03,61.53 38.03,59.63 U2.3 ; 40.21,71.88 41.97,71.88 41.97,70.12 41.74,69.88 ; 41.74,69.88 42.28,69.34 42.28,58.69 39.97,58.69 39.05,59.6 ; 41.74,69.88 40.21,69.88

Small or netless copper shapes (teardrops, artwork), in the pictures only: 435 on Top Layer, 103 on Bottom Layer, 61 on 信号层1, 15 on 信号层2
